# Altium schematic sheet 3.MCU.SchDoc
size A4; SheetNumber: 3; SheetTotal: 5
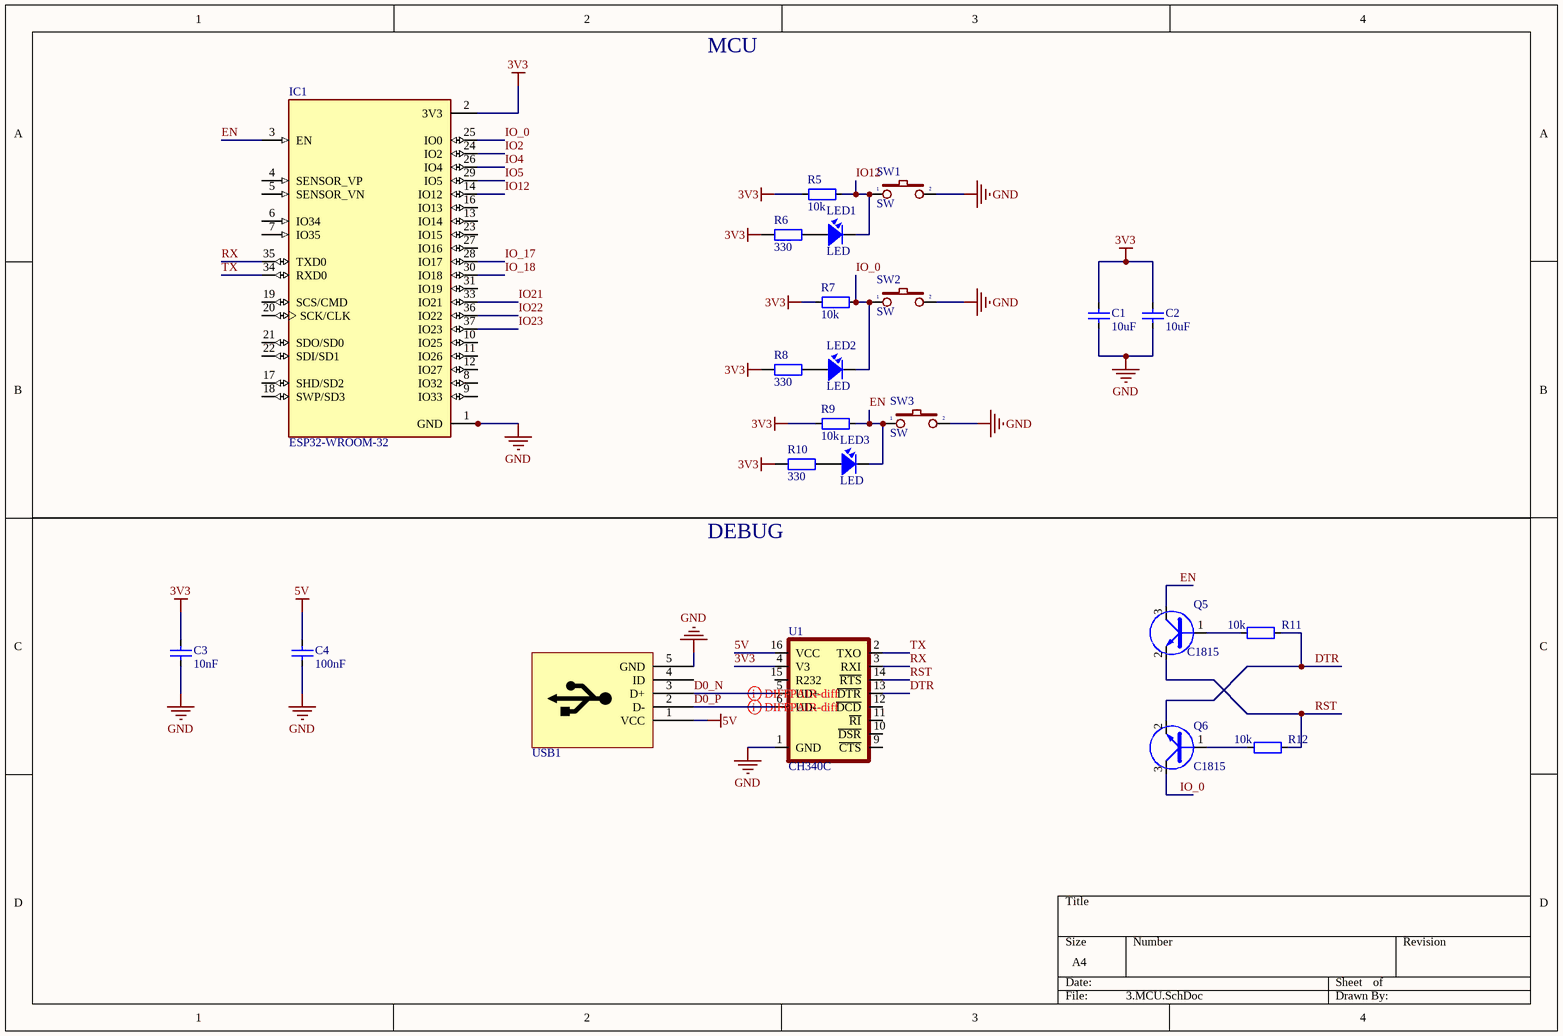
[diagram p0: 3.MCU.SchDoc]

## Parts
C1  10uF  [CAP_0805]
C2  10uF  [CAP_0805]
C3  10nF  [CAP_0805]
C4  100nF  [CAP_0805]
IC1  ESP32-WROOM-32  [MODULE_ESP32-WROOM-32]
LED1  LED  [LED-0805-Blue]
LED2  LED  [LED-0805-Blue]
LED3  LED  [LED-0805-Blue]
Q5  C1815  [SOT23D]
Q6  C1815  [SOT23D]
R5  10k  [RES-SMD-0805]
R6  330  [RES-SMD-0805]
R7  10k  [RES-SMD-0805]
R8  330  [RES-SMD-0805]
R9  10k  [RES-SMD-0805]
R10  330  [RES-SMD-0805]
R11  10k  [RES-SMD-0805]
R12  10k  [RES-SMD-0805]
SW1  SW  [SW2]
SW2  SW  [SW2]
SW3  SW  [SW2]
U1  CH340C  [SOP-16]
USB1  USB  [USB-M1]  (value not drawn)

## Nets
3V3: C1.1 C2.1 C3.1 IC1.2(3V3) R5.2 R6.2 R7.2 R8.2 R9.2 R10.2 U1.4(V3)
5V: C4.1 U1.16(VCC) USB1.1(VCC)
GND: C1.2 C2.2 C3.2 C4.2 IC1.1(GND) IC1.15(GND) IC1.38(GND) IC1.39_1(GND) IC1.39_2(GND) IC1.39_3(GND) IC1.39_4(GND) IC1.39_5(GND) IC1.39_6(GND) IC1.39_7(GND) IC1.39_8(GND) IC1.39_9(GND) IC1.39_10(GND) IC1.39_11(GND) IC1.39_12(GND) IC1.39_13(GND) IC1.39_14(GND) IC1.39_15(GND) IC1.39_16(GND) IC1.39_17(GND) IC1.39_18(GND) IC1.39_19(GND) IC1.39_20(GND) IC1.39_21(GND) SW1.2 SW2.2 SW3.2 U1.1(GND) USB1.5(GND)
D0_N: U1.5(UD+) USB1.3(D+)
D0_P: U1.6(UD-) USB1.2(D-)
DTR: Q6.2(E) R11.1 U1.13(~{DTR})
EN: IC1.3(EN) LED3.2 Q5.3(C) R9.1 SW3.1
IO2: IC1.24(IO2)
IO4: IC1.26(IO4)
IO5: IC1.29(IO5)
IO12: IC1.14(IO12) LED1.2 R5.1 SW1.1
IO21: IC1.33(IO21)
IO22: IC1.36(IO22)
IO23: IC1.37(IO23)
IO_0: IC1.25(IO0) LED2.2 Q6.3(C) R7.1 SW2.1
IO_17: IC1.28(IO17)
IO_18: IC1.30(IO18)
RST: Q5.2(E) R12.1 U1.14(~{RTS})
RX: IC1.35(TXD0) U1.3(RXI)
TX: IC1.34(RXD0) U1.2(TXO)
NetLED1_1: LED1.1 R6.1
NetLED2_1: LED2.1 R8.1
NetLED3_1: LED3.1 R10.1
NetQ5_1: Q5.1(B) R11.2
NetQ6_1: Q6.1(B) R12.2

Not connected (* = marked no-connect by the designer): IC1 4(SENSOR_VP) 5(SENSOR_VN) 6(IO34) 7(IO35) 8(IO32) 9(IO33) 10(IO25) 11(IO26) 12(IO27) 13(IO14) 16(IO13) 17(SHD/SD2) 18(SWP/SD3) 19(SCS/CMD) 20(SCK/CLK) 21(SDO/SD0) 22(SDI/SD1) 23(IO15) 27(IO16) 31(IO19); U1 9(~{CTS}) 10(~{DSR}) 11(~{RI}) 12(~{DCD}) 15(R232); USB1 4(ID)

## Layout directives
differential pair; differential pair class diff: D0_N, D0_P

## Notes on the sheet
- MCU
- DEBUG

## Library data of the parts
C1-C4 = CapSMD: Capacitor; Value: 33p; Published: 8-Jun-2000; LatestRevisionDate: 17-Jul-2002; LatestRevisionNote: Re-released for DXP Platform.; PackageReference: RAD-0.3; Publisher: Altium Limited
IC1 = ESP32-WROOM-32: Bluetooth, WiFi Transceiver Module 2.4GHz ~ 2.5GHz Surface Mount; MF: Espressif Systems; Package: Module Espressif Systems; Digi-Key_Part_Number: 1904-1010-1-ND; Digi-Key_Purchase_URL: https://www.digikey.com/product-detail/en/espressif-systems/ESP32-WROOM-32/1904-1010-1-ND/8544305?utm_source=snapeda&utm_medium=aggregator&utm_campaign=symbol; Value: *; MP: ESP32-WROOM-32; SnapEDA_Link: https://www.snapeda.com/parts/ESP32-WROOM-32/Espressif%20Systems/view-part/2753322/?ref=snap
LED1-LED3 = LED: LED Single colour Green and Red; Value: LED 3 ly Single Colour
Q5 Q6 = 2SC1815: NPN 600mW, ECB; Value: C1815
R5 R7 R9 R11 R12 = Resistor - SMD: Resistor; Manufacturer: Generic Components; Class: Passive; Published: 08/06/2000; Publisher: Altium Hobart Technology Centre
R6 R8 R10 = Resistor - SMD: Resistor SMD; Manufacturer: Generic Components; Class: Passive; Published: 08/06/2000; Publisher: Altium Hobart Technology Centre
SW1-SW3 = SW2: Switch button 2 pin; Value: SW chip 2 pin
U1 = CH340C: USB to serial chip CH340; MF: WCH; Package: Package; Check_prices: https://www.snapeda.com/parts/CH340C/WCH/view-part/5428851/?ref=eda; Value: *; Price: None; MP: CH340C; Availability: Unavailable; SnapEDA_Link: https://www.snapeda.com/parts/CH340C/WCH/view-part/5428851/?ref=snap
USB1 = USB-M